# Altium schematic sheet Sumo_Motor_Stepper_DC_Conns.SCHDOC
size A
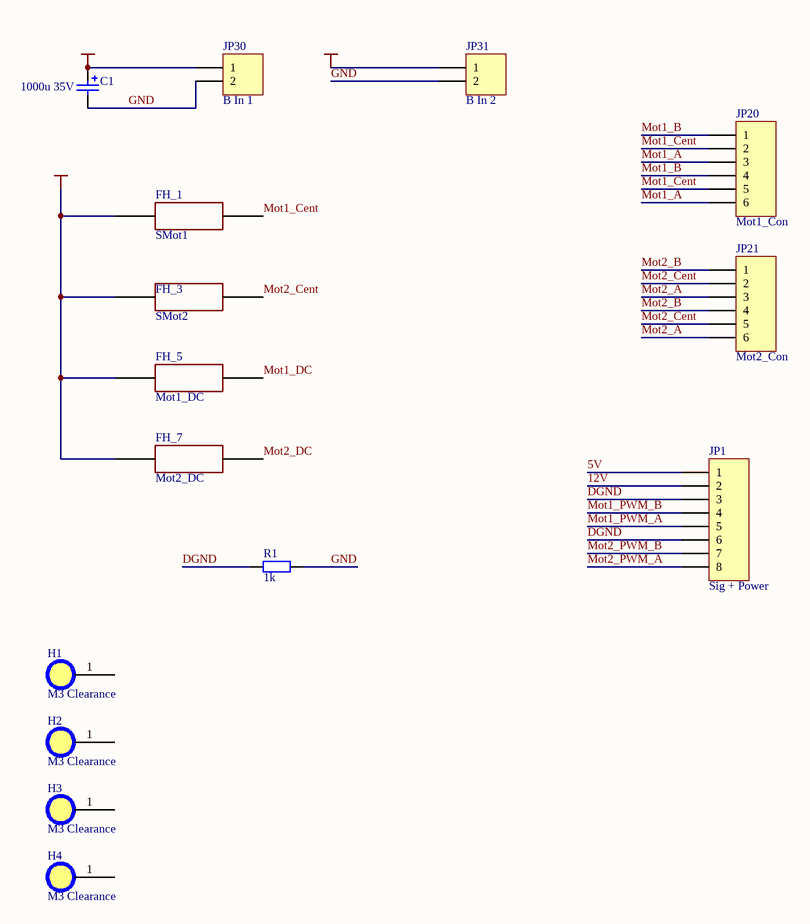
[diagram p0: Sumo_Motor_Stepper_DC_Conns.SCHDOC]

## Parts
C1  value 1000u 35V  [CAPPOL7.5-16]  (hidden comment: Cap Pol1)
FH_1  SMot1  [FuseHolder Miniblade]
FH_3  SMot2  [FuseHolder Miniblade]
FH_5  Mot1_DC  [FuseHolder Miniblade]
FH_7  Mot2_DC  [FuseHolder Miniblade]
H1  M3 Clearance  [M3 Clearance]
H2  M3 Clearance  [M3 Clearance]
H3  M3 Clearance  [M3 Clearance]
H4  M3 Clearance  [M3 Clearance]
JP1  Sig + Power  [PHR 1x8 2mm]
JP20  Mot1_Con  [microfit 2x3 3mm]
JP21  Mot2_Con  [microfit 2x3 3mm]
JP30  B In 1  [Screw Terminals x 2 x M4]
JP31  B In 2  [Mini-Fit Jnr 2x1 4.2mm]
R1  value 1k  [CR2012-0805]  (hidden comment: Res Semi)

## Nets
VBat: C1.1 FH_1.1 FH_3.1 FH_5.2 FH_7.2 JP30.1 JP31.1
5V: JP1.1
12V: JP1.2
DGND: JP1.3 JP1.6 R1.2
GND: C1.2 JP30.2 JP31.2 R1.1
Mot1_A: JP20.3
Mot1_~{A}: JP20.6
Mot1_B: JP20.1
Mot1_~{B}: JP20.4
Mot1_Cent: FH_1.2 JP20.2 JP20.5
Mot1_DC: FH_5.1
Mot1_PWM_A: JP1.5
Mot1_PWM_B: JP1.4
Mot2_A: JP21.3
Mot2_~{A}: JP21.6
Mot2_B: JP21.1
Mot2_~{B}: JP21.4
Mot2_Cent: FH_3.2 JP21.2 JP21.5
Mot2_DC: FH_7.1
Mot2_PWM_A: JP1.8
Mot2_PWM_B: JP1.7

Not connected (* = marked no-connect by the designer): H1 1; H2 1; H3 1; H4 1

## Library data of the parts
C1 = Cap Pol1: Polarized Capacitor (Radial); Published: 8-Jun-2000; Revision: July-2002: Re-released for DXP Platform.; Publisher: Altium Limited
FH_1 FH_3 FH_5 = Fuse_Holder: Fuse Holder
FH_7 = Fuse_Holder
H1-H4 = M3 Clearance hole: 3.2mm ID clearance hole for M3 screw
JP1 = Header 8: Header, 8-Pin; Revision: 17-Jul-2002: Re-released for DXP Platform.; Publisher: Altium Limited
JP20 JP21 = Header 6: Header, 6-Pin; Revision: 17-Jul-2002: Re-released for DXP Platform.; Publisher: Altium Limited
JP30 JP31 = Header 2: Header, 2-Pin; Revision: 17-Jul-2002: Re-released for DXP Platform.; Publisher: Altium Limited
R1 = Res Semi: Semiconductor Resistor; Published: 8-Jun-2000; Revision: July-2002: Re-released for DXP Platform.; Publisher: Altium Limited